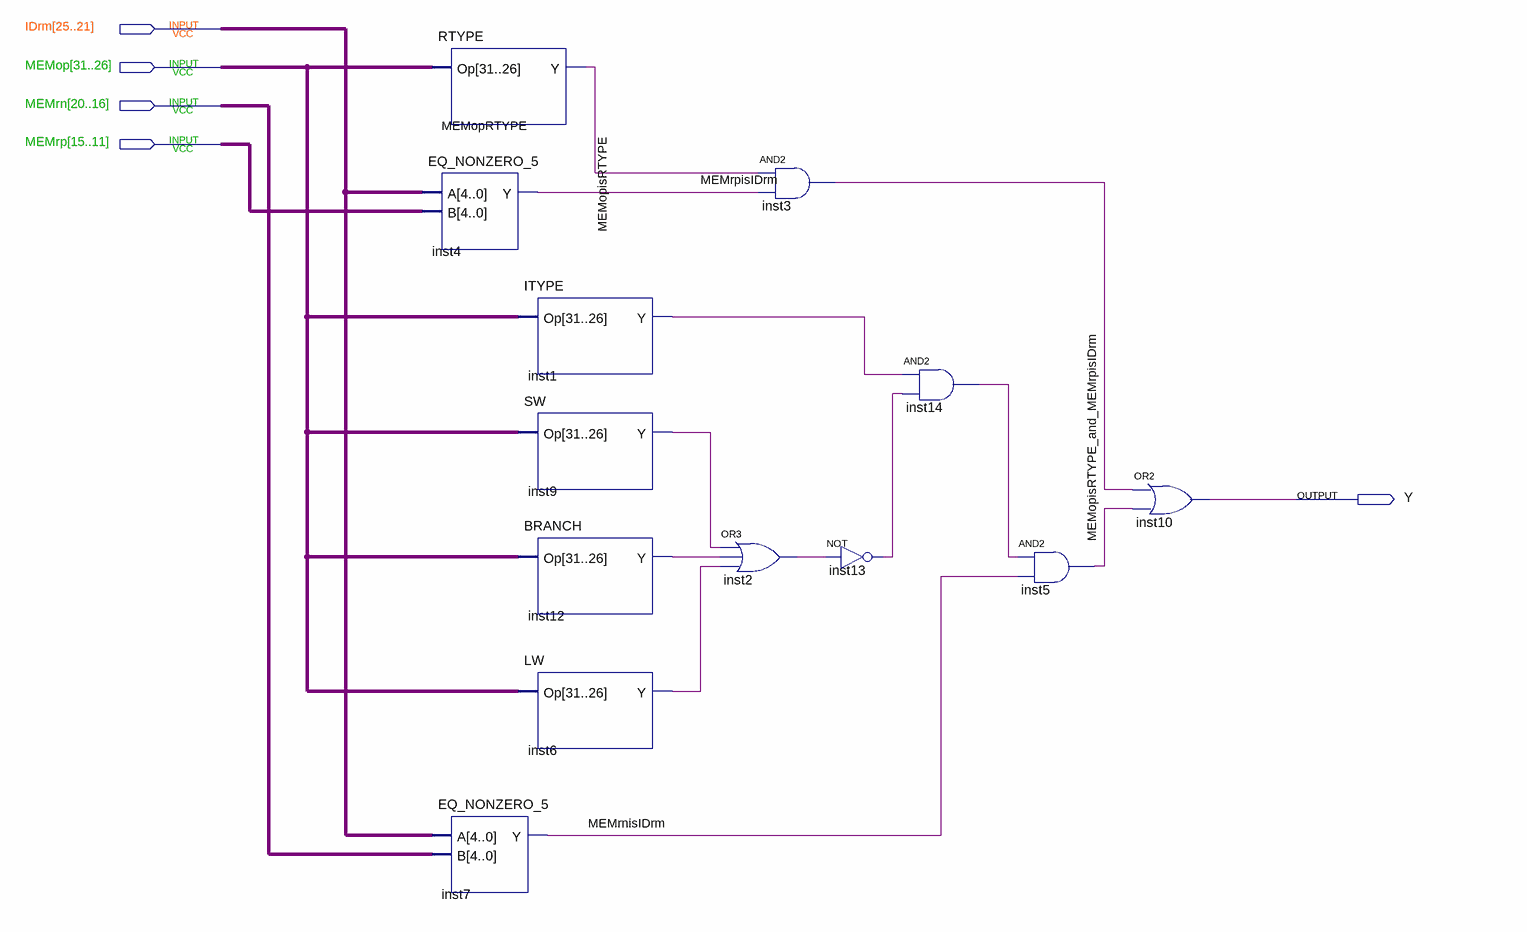
[diagram p0: schematic sheet]
// Quartus schematic ForwardAfromMEMtoID.bdf as structural Verilog: 13 symbols, 5 pins
module ForwardAfromMEMtoID (
  input  [25:21] IDrm,
  input  [31:26] MEMop,
  input  [20:16] MEMrn,
  input  [15:11] MEMrp,
  output Y
);

  wire inst1_y, inst2_out, inst5_out, inst6_y, inst9_y, inst12_y, inst13_out, inst14_out, MEMopisRTYPE,
       MEMopisRTYPE_and_MEMrpisIDrm, MEMrnisIDrm, MEMrpisIDrm;

  RTYPE MEMopRTYPE (.Op(MEMop), .Y(MEMopisRTYPE));
  EQ_NONZERO_5 inst4 (.A(IDrm), .B(MEMrp), .Y(MEMrpisIDrm));
  EQ_NONZERO_5 inst7 (.A(IDrm), .B(MEMrn), .Y(MEMrnisIDrm));
  ITYPE inst1 (.Op(MEMop), .Y(inst1_y));
  SW inst9 (.Op(MEMop), .Y(inst9_y));
  BRANCH inst12 (.Op(MEMop), .Y(inst12_y));
  LW inst6 (.Op(MEMop), .Y(inst6_y));
  or inst2 (inst2_out, inst9_y, inst12_y, inst6_y);
  and inst3 (MEMopisRTYPE_and_MEMrpisIDrm, MEMopisRTYPE, MEMrpisIDrm);
  not inst13 (inst13_out, inst2_out);
  and inst14 (inst14_out, inst1_y, inst13_out);
  and inst5 (inst5_out, inst14_out, MEMrnisIDrm);
  or inst10 (Y, MEMopisRTYPE_and_MEMrpisIDrm, inst5_out);
endmodule
